# Altium schematic sheet EPM240T100C5N.SchDoc
size Letter
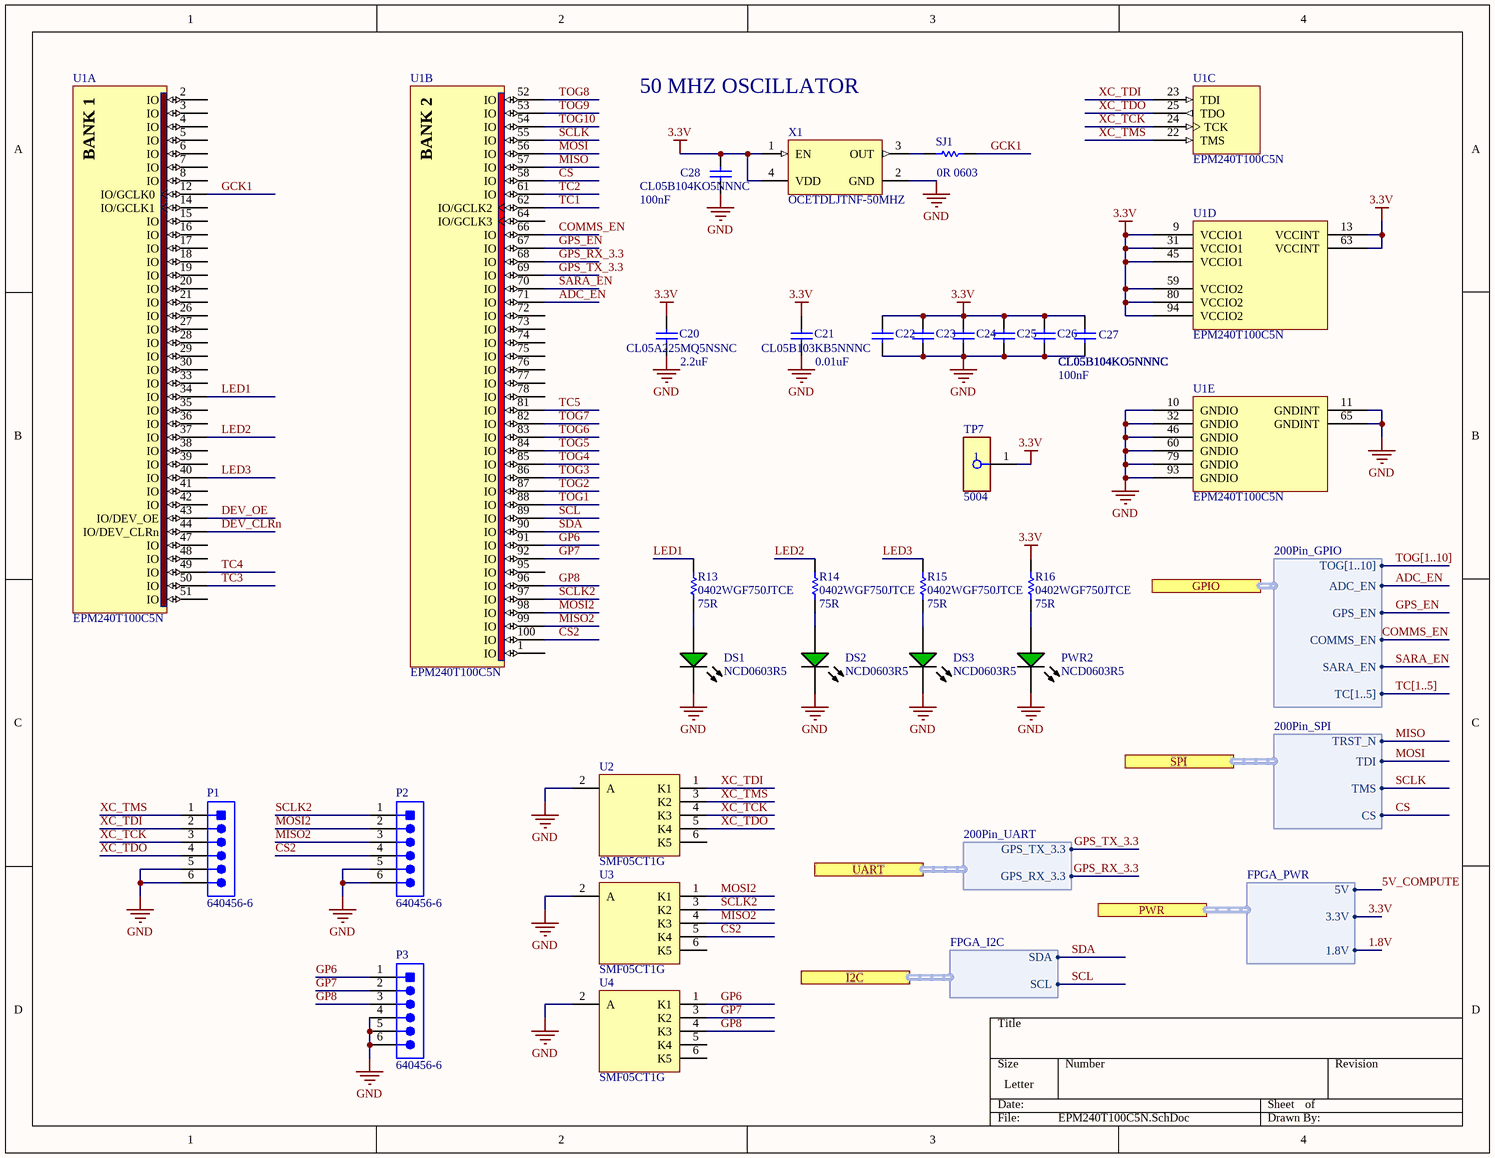
[diagram p0: EPM240T100C5N.SchDoc]

## Parts
C20  CL05A225MQ5NSNC  [CAPC0402(1005)60_M]
C21  CL05B103KB5NNNC  [CAPC1005X55X30NL05T10]
C22  CL05B104KO5NNNC  [CAPC1005X55X30ML05T10]
C23  CL05B104KO5NNNC  [CAPC1005X55X30ML05T10]
C24  CL05B104KO5NNNC  [CAPC1005X55X30ML05T10]
C25  CL05B104KO5NNNC  [CAPC1005X55X30ML05T10]
C26  CL05B104KO5NNNC  [CAPC1005X55X30ML05T10]
C27  CL05B104KO5NNNC  [CAPC1005X55X30ML05T10]
C28  CL05B104KO5NNNC  [CAPC1005X55X30ML05T10]
DS1  NCD0603R5  [AVAG-HSMX-C190_V]
DS2  NCD0603R5  [AVAG-HSMX-C190_V]
DS3  NCD0603R5  [AVAG-HSMX-C190_V]
P1  640456-6  [TECO-640456-6_V]
P2  640456-6  [TECO-640456-6_V]
P3  640456-6  [TECO-640456-6_V]
PWR2  NCD0603R5  [AVAG-HSMX-C190_V]
R13  0402WGF750JTCE  spec: 75R  [RESC1005X40X25ML05T10]
R14  0402WGF750JTCE  spec: 75R  [RESC1005X40X25ML05T10]
R15  0402WGF750JTCE  spec: 75R  [RESC1005X40X25ML05T10]
R16  0402WGF750JTCE  spec: 75R  [RESC1005X40X25ML05T10]
SJ1  0R 0603  [RESC1609X55X30ML10T20]
TP7  5004  [FP-5004-MFG]
U1  EPM240T100C5N  [TQFP100_L]  (parts A,B,C,D,E of 5)
U2  SMF05CT1G  [ONSC-SC70-6-419B-02_W_V]
U3  SMF05CT1G  [ONSC-SC70-6-419B-02_W_V]
U4  SMF05CT1G  [ONSC-SC70-6-419B-02_W_V]
X1  OCETDLJTNF-50MHZ  [TXC-L500W700H130-4_V]

## Ports
GPIO (harness 200Pin_GPIO), I2C (harness FPGA_I2C), PWR (harness FPGA_PWR), SPI (harness 200Pin_SPI), UART (harness 200Pin_UART)

## Harnesses
FPGA_I2C: SDA, SCL
200Pin_UART: GPS_TX_3.3, GPS_RX_3.3
FPGA_PWR: 5V, 3.3V, 1.8V
200Pin_SPI: TRST_N, TDI, TMS, CS
200Pin_GPIO: TOG[1..10], ADC_EN, GPS_EN, COMMS_EN, SARA_EN, TC[1..5]

## Nets
3.3V: C20.2 C21.2 C22.2 C23.2 C24.2 C25.2 C26.2 C27.2 C28.2 R16.2 TP7.1 U1.9(VCCIO1) U1.13(VCCINT) U1.31(VCCIO1) U1.45(VCCIO1) U1.59(VCCIO2) U1.63(VCCINT) U1.80(VCCIO2) U1.94(VCCIO2) X1.1(EN) X1.4(VDD) ; port PWR.3.3V
GND: C20.1 C21.1 C22.1 C23.1 C24.1 C25.1 C26.1 C27.1 C28.1 DS1.2(K) DS2.2(K) DS3.2(K) P1.5 P1.6 P2.5 P2.6 P3.4 P3.5 P3.6 PWR2.2(K) U1.10(GNDIO) U1.11(GNDINT) U1.32(GNDIO) U1.46(GNDIO) U1.60(GNDIO) U1.65(GNDINT) U1.79(GNDIO) U1.93(GNDIO) U2.2(A) U3.2(A) U4.2(A) X1.2(GND)
1.8V: port PWR.1.8V
5V_COMPUTE: port PWR.5V
ADC_EN: U1.71(IO) ; port GPIO.ADC_EN
COMMS_EN: U1.66(IO) ; port GPIO.COMMS_EN
CS: U1.58(IO) ; port SPI.CS
CS2: P2.4 U1.100(IO) U3.5(K4)
DEV_CLRn: U1.44(IO/DEV_CLRn)
DEV_OE: U1.43(IO/DEV_OE)
GCK1: SJ1.2 U1.12(IO/GCLK0)
GP6: P3.1 U1.91(IO) U4.1(K1)
GP7: P3.2 U1.92(IO) U4.3(K2)
GP8: P3.3 U1.96(IO) U4.4(K3)
GPS_EN: U1.67(IO) ; port GPIO.GPS_EN
GPS_RX_3.3: U1.68(IO) ; port UART.GPS_RX_3.3
GPS_TX_3.3: U1.69(IO) ; port UART.GPS_TX_3.3
LED1: R13.2 U1.34(IO)
LED2: R14.2 U1.37(IO)
LED3: R15.2 U1.40(IO)
MISO: U1.57(IO) ; port SPI.TRST_N
MISO2: P2.3 U1.99(IO) U3.4(K3)
MOSI: U1.56(IO) ; port SPI.TDI
MOSI2: P2.2 U1.98(IO) U3.1(K1)
SARA_EN: U1.70(IO) ; port GPIO.SARA_EN
SCL: U1.89(IO) ; port I2C.SCL
SCLK: U1.55(IO) ; port SPI.TMS
SCLK2: P2.1 U1.97(IO) U3.3(K2)
SDA: U1.90(IO) ; port I2C.SDA
TC1: U1.62(IO/GCLK2)
TC2: U1.61(IO)
TC3: U1.50(IO)
TC4: U1.49(IO)
TC5: U1.81(IO)
TOG1: U1.88(IO)
TOG2: U1.87(IO)
TOG3: U1.86(IO)
TOG4: U1.85(IO)
TOG5: U1.84(IO)
TOG6: U1.83(IO)
TOG7: U1.82(IO)
TOG8: U1.52(IO)
TOG9: U1.53(IO)
TOG10: U1.54(IO)
XC_TCK: P1.3 U1.24(TCK) U2.4(K3)
XC_TDI: P1.2 U1.23(TDI) U2.1(K1)
XC_TDO: P1.4 U1.25(TDO) U2.5(K4)
XC_TMS: P1.1 U1.22(TMS) U2.3(K2)
NetDS1_1: DS1.1(A) R13.1
NetDS2_1: DS2.1(A) R14.1
NetDS3_1: DS3.1(A) R15.1
NetPWR2_1: PWR2.1(A) R16.1
NetSJ1_1: SJ1.1 X1.3(OUT)

Not connected (* = marked no-connect by the designer): U1 1(IO) 2(IO) 3(IO) 4(IO) 5(IO) 6(IO) 7(IO) 8(IO) 14(IO/GCLK1) 15(IO) 16(IO) 17(IO) 18(IO) 19(IO) 20(IO) 21(IO) 26(IO) 27(IO) 28(IO) 29(IO) 30(IO) 33(IO) 35(IO) 36(IO) 38(IO) 39(IO) 41(IO) 42(IO) 47(IO) 48(IO) 51(IO) 64(IO/GCLK3) 72(IO) 73(IO) 74(IO) 75(IO) 76(IO) 77(IO) 78(IO) 95(IO); U2 6(K5); U3 6(K5); U4 5(K4) 6(K5)

## Buses and harness runs
bus TC[1..5]
bus TOG[1..10]

## Notes on the sheet
- 50 MHZ OSCILLATOR
- (near C28) 100nF
- (near C20) 2.2uF
- (near C21) 0.01uF
- 100nF
- (in symbol CMP-0144-00227-1, part A) BANK 1
- (in symbol CMP-0144-00227-1, part B) BANK 2

## Library data of the parts
C20 = CMP-1034-02125-1: 2.2uF 0402; Case-Metric: 1005; Rated Voltage: 6.3 V; Case-EIA: 0402; Tolerance: Â±10%; Value: 2.2uF; Technology: SMT; Max Thickness: 0.6 mm
C21 = CMP-2008-03072-1: 0.01uF 0402; Manufacturer: Kemet; Part Number: C0402C103K4RACTU
C22-C28 = CMP-2008-03080-1: 100nF 0402; Manufacturer: Kemet; Part Number: C0402C104J4RACTU
DS1-DS3 PWR2 = CMP-1744-00002-1: Chip LED, Green, 2.2 V, -40 to 85 degC, 2-Pin SMD, RoHS, Tape and Reel; Frequency: 400 KHz; Max Supply Voltage: 5.5 V; Access Time: 3500 ns; Clock Frequency: 100 KHz; Case\Package: SOIC; Density: 32 kb; Nominal Supply Current: 2 mA; Interface: Serial; Min Supply Voltage: 1.7 V; Packaging: Tape and Reel; PackageReference: HSMX-C190; ComponentLink2URL: http://docs.avagotech.com/docs/AV02-0551EN; RoHSCompliant: true; Pins: 8; REACH SVHC: No SVHC; Max Operating Temperature: 85 degC; Width: 4 mm; Radiation Hardening: No; Package Quantity: 3000; ComponentLink3Description: Package Specification; ComponentLink1Description: Manufacturer URL; Min Operating Temperature: -40 degC; PackageDescription: 2-Pin Surface Mount Device, Body 1.6 x 0.8 mm, Height 0.9 mm; Max Clock Frequency: 100 KHz; Height: 1.5 mm; ComponentLink1URL: http://www.avagotech.com/; DatasheetVersion: Mar-12; ComponentLink2Description: Datasheet; Mount: Surface Mount; Length: 5 mm; ComponentLink3URL: http://www.fairchildsemi.com/dwg/MA/MA03D.pdf
P1-P3 = CMP-2000-05661-1: Male Header, Pitch 2.54 mm, 1 x 6 Position, Height 10.03 mm, Tail Length 3.56 mm, -55 to 105 degC, Bulk; Manufacturer: TE Connectivity; Contact Centerline Spacing: 0.100 / in.; Number of Contacts: 6; Current, Rating: 5 / A; Agency Approvals: CSA,UL; Material, Contact: CopperAlloy; Mounting Hole Size: 0.04 / "; Brand/Series: MTA-100Series; Pin Spacing: 0.1 / "; Mount Angle: Vertical; Contact Termination Area Plating: Tin; Angle: Straight; Primary Type: InterconnectSystem; Standards: RoHSCompliant,ELVCompliant,UL94V-0; Temperature, Operating: -55to+105 / °C; Material, Housing: Polyester; Special Features: Pinstrip; Color, Housing: White; Connector Type: MTA-100; Voltage, Rating: 250 / V; Termination: Solder; Package Reference: 640456-6; Size, Post: 0.025 / in.; Color: White; Datasheet URL: https://datasheet.ciiva.com/25618/0900766b80eb7fdd-25618163.pdf; Manufacturer URL: http://www.te.com/; Mounting Type: PCMount; Length, Pin: 0.14 / "; Type: PCBPlug; Length, Overall: 0.6 / "; Mounting Technology: ThroughHole; Number of Rows: 1; Contact Shape: Square; Contact Mating Area Plating: Tin; Datasheet Version: Rev. W, 05/2005; Number of Positions: 6; Package Description: Male Header, Pitch 2.54 mm, 1 x 6 Position, Height 10.03 mm, Tail Length 3.56 mm; Contact Plating: Tin; Length, Terminal Post: 0.14 / in.; Flammability Rating: UL94V-0
R13-R16 = CMP-2002-07344-1: 75R 0402; Part Number: RC0402FR-07100RL; Manufacturer: Yageo / Phycomp
SJ1 = CMP-2000-03816-1: Part Number: CRCW06030000Z0EA; Manufacturer: Vishay Dale
TP7 = CMP-2000-05575-2: PC TEST POINT MINIATURE YELLOW; Manufacturer: Keystone; Number Of Contacts: 1; Is Female: yes; Device Class L1: Connectors; Manufacturer Part Number: 5004; Digikey Description: PC TEST POINT MINIATURE YELLOW; ComponentLink2URL: https://www.keyelco.com/product-pdf.cfm?p=1313; Lead Free: Yes; ComponentLink2Description: Datasheet; Category: Conn; Height: 4.72mm; Octopart: https://octopart.com/5004-keystone-28591; Mouser Description: TEST POINT PC MINI .040"D YELLOW; Device Class L3: unset; Contact Material: Silver; Package: 5004; Automotive: No; Device Class L2: unset; RoHS: TRUE
U1 = CMP-0144-00227-1: MAX II 3.3/2.5V CPLD, 80 IOs, 240 Logic Elements, 100-Pin Plastic TQFP, Commercial Temperature, Speed Grade 5, Pb-Free; Note1: Each set of VCCIO pins can be connected to 3.3V, 2.5V, 1.8V, or 1.5V.; Note2: All VCCINT pins must be connected to either 3.3V or 2.5V (but not a combination of both).; PackageDescription: 100-Pin Plastic Thin Quad Flat Pack (TQFP100) - Wire Bond; PackageReference: TQFP100; PackageVersion: ver15.1, May-2008; DatasheetVersion: ver1.8, Jul-2006; Code_JEDEC: MS-026-AED
U2-U4 = CMP-1061-00155-1: 5-Line Transient Voltage Suppressor Array, 6-Pin SC70, Pb-Free, Tape and Reel; Manufacturer: On Semiconductor; PPK Max (W): 100; Direction: Unidirectional; IR Max (uA): 5; PackageDescription: 6-Pin Small Outline Transistor, Body 2 x 1.25 mm, Pitch 0.65 mm; PackageReference: SC70-6-419B-02_W; ComponentLink2Description: Datasheet; Mounting Technology: Surface Mount; Packing: Tape and Reel; DatasheetVersion: Rev. 4; ComponentLink1Description: Manufacturer URL; ComponentLink2URL: http://www.onsemi.com/pub_link/Collateral/SMF05C-D.PDF; ComponentLink3Description: Package Specification; ComponentLink1URL: http://www.onsemi.com/; ComponentLink3URL: http://www.onsemi.com/pub_link/Collateral/SMF05C-D.PDF; PackageVersion: Rev. W; PartNumber: SMF05CT1G; RoHS: Pb-Free
X1 = CMP-0269-00001-1: OSC, 50.000 MHZ, ± 25 ppm, 3.3 V, SMT / OCETDLJTNF-50MHZ; PartNumber: 7W-50.000MBA-T; Rise/Fall Time: 7 ns; Body Shape: Rectangular, 4 SMD; Frequency Stability: Â± 25 ppm(-10 to +70 degC); ComponentLink2Description: Datasheet; Mounting Technology: Surface Mount; Storage Temperature: -50 to 125 degC; PackageReference: L500W700H130-4; ComponentLink1URL: http://www.txccrystal.com/; ComponentLink2URL: http://www.txccrystal.com/images/pdf/7w-tight.pdf; ComponentLink1Description: Manufacturer URL; PackageDescription: 4-Pin SMT LED, 7 x 5 mm Body; Operating Temperature Range: -40 to 85 degC